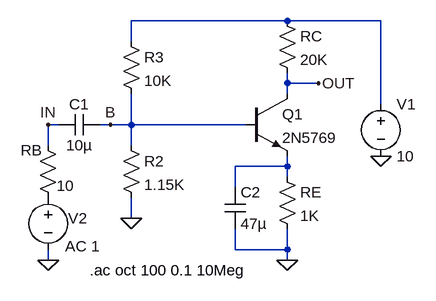
[diagram p0: schematic Fig_3-23_1_Tr_Amp_AC.asc]
Fig_3-23_1_Tr_Amp_AC.asc, the LTspice schematic file:
Version 4
SHEET 1 880 680
WIRE 192 64 -48 64
WIRE 336 64 192 64
WIRE -48 96 -48 64
WIRE 192 160 192 144
WIRE 240 160 192 160
WIRE 192 176 192 160
WIRE 336 192 336 64
WIRE -160 224 -176 224
WIRE -80 224 -96 224
WIRE -48 224 -48 176
WIRE -48 224 -80 224
WIRE 128 224 -48 224
WIRE -176 256 -176 224
WIRE -48 256 -48 224
WIRE 192 288 192 272
WIRE 192 288 112 288
WIRE 192 304 192 288
WIRE 112 320 112 288
WIRE -48 368 -48 336
WIRE 112 416 112 384
WIRE 192 416 192 384
WIRE 192 416 112 416
WIRE -176 432 -176 416
WIRE 192 432 192 416
FLAG 192 432 0
FLAG -176 432 0
FLAG 336 272 0
FLAG 240 160 OUT
FLAG -176 224 IN
FLAG -48 368 0
FLAG -80 224 B
DATAFLAG 32 224 ""
SYMBOL npn 128 176 R0
SYMATTR InstName Q1
SYMATTR Value 2N5769
SYMBOL res 176 48 R0
SYMATTR InstName RC
SYMATTR Value 20K
SYMBOL res 176 288 R0
SYMATTR InstName RE
SYMATTR Value 1K
SYMBOL voltage 336 176 R0
WINDOW 123 0 0 Left 2
WINDOW 39 0 0 Left 2
SYMATTR InstName V1
SYMATTR Value 10
SYMBOL voltage -176 320 R0
WINDOW 123 26 91 Left 2
WINDOW 39 0 0 Left 2
WINDOW 0 31 48 Left 2
WINDOW 3 -13 134 Left 2
SYMATTR Value2 AC 1
SYMATTR InstName V2
SYMATTR Value ""
SYMBOL res -192 240 R0
WINDOW 0 -26 23 Left 2
WINDOW 3 29 78 Left 2
SYMATTR InstName RB
SYMATTR Value 10
SYMBOL res -64 80 R0
SYMATTR InstName R3
SYMATTR Value 10K
SYMBOL res -64 240 R0
SYMATTR InstName R2
SYMATTR Value 1.15K
SYMBOL cap -160 240 R270
WINDOW 0 32 32 VTop 2
WINDOW 3 0 32 VBottom 2
SYMATTR InstName C1
SYMATTR Value 10µ
SYMBOL cap 96 320 R0
SYMATTR InstName C2
SYMATTR Value 47µ
TEXT -112 448 Left 2 !.ac oct 100 0.1 10Meg

The netlist it stands for:
* Fig_3-23_1_Tr_Amp_AC.asc
Q1 OUT B N002 0 2N5769
RC N001 OUT 20K
RE N002 0 1K
V1 N001 0 10
V2 P001 0 AC 1
RB IN P001 10
R3 N001 B 10K
R2 B 0 1.15K
C1 IN B 10µ
C2 N002 0 47µ
.model NPN NPN
.model PNP PNP
.lib standard.bjt
.ac oct 100 0.1 10Meg
.backanno
.end